# Altium schematic sheet CAN_PHY.SchDoc: CAN PHY
size A3; Author: Silvio Navaretti; CompanyName: ARDUINO; DrawnBy: Silvio Navaretti; Engineer: Silvio Navaretti; Organization: ARDUINO; SheetNumber: 48; SheetTotal: 51; RevAuthor: Silvio Navaretti
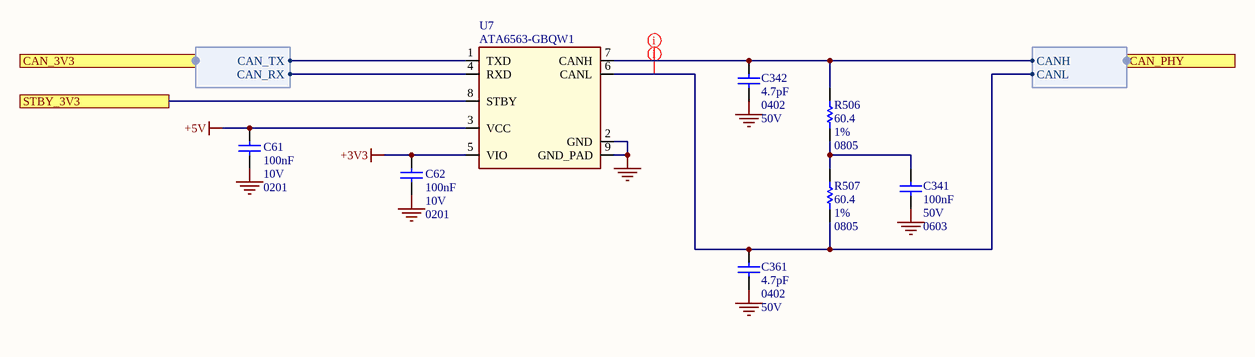
[diagram p0: CAN_PHY.SchDoc]

## Parts
C61  value 100nF  Voltage: 10V  Case Code (Imperial): 0201  [CAP-0201]  (hidden comment: CL03A104KP3NNNC)
C62  value 100nF  Voltage: 10V  Case Code (Imperial): 0201  [CAP-0201]  (hidden comment: CL03A104KP3NNNC)
C341  value 100nF  Voltage: 50V  Case Code (Imperial): 0603  [CAP-0603]  (hidden comment: 0603B104K500CT)
C342  value 4.7pF  Case Code (Imperial): 0402  Voltage: 50V  [CAP-0402]  (hidden comment: 04025A4R7DAT2A)
C361  value 4.7pF  Case Code (Imperial): 0402  Voltage: 50V  [CAP-0402]  (hidden comment: 04025A4R7DAT2A)
R506  value 60.4  Tolerance: 1%  Case Code (Imperial): 0805  [RES-0805]  (hidden comment: RT0805FRE0760R4L)
R507  value 60.4  Tolerance: 1%  Case Code (Imperial): 0805  [RES-0805]  (hidden comment: RT0805FRE0760R4L)
U7  ATA6563-GBQW1  [Microchip VDFN8 pitch 0.65mm 3x3mm exposed pad 2.4x1.6mm]

## Ports
CAN_3V3 (harness CAN), CAN_PHY (harness CAN_PHY), STBY_3V3

## Harnesses
CAN: CAN_TX, CAN_RX
CAN_PHY: CANH, CANL

## Nets
+3V3: C62.2 U7.5(VIO)
+5V: C61.2 U7.3(VCC)
GND: C61.1 C62.1 C341.2 C342.2 C361.2 U7.2(GND) U7.9(GND_PAD)
STBY_3V3: U7.8(STBY) ; port STBY_3V3
NetC341_1: C341.1 R506.1 R507.2
NetC342_1: C342.1 R506.2 U7.7(CANH) ; port CAN_PHY.CANH
NetC361_1: C361.1 R507.1 U7.6(CANL) ; port CAN_PHY.CANL
NetU7_1: U7.1(TXD) ; port CAN_3V3.CAN_TX
NetU7_4: U7.4(RXD) ; port CAN_3V3.CAN_RX

## Layout directives
net class HIGH_CLEARANCE: NetC342_1, NetC361_1

## Notes on the sheet
- Title:
- ID:
- Date:
- Time:
- Version:
- Sheet
- of
- RevAuthor:
- Reference Designs ARE PROVIDED "AS IS" AND "WITH ALL FAULTS. Arduino SA DISCLAIMS ALL OTHER WARRANTIES, EXPRESS OR IMPLIED, REGARDING PRODUCTS, INCLUDING BUT NOT LIMITED TO, ANY IMPLIED WARRANTIES OF MERCHANTABILITY OR FITNESS FOR A PARTICULAR PURPOSE.
  Arduino SA may make changes to specifications and product descriptions at any time, without notice. The Customer must not rely on the absence or characteristics of any features or instructions marked "reserved" or "undefined".
  Arduino SA reserves these for future definition and shall have no responsibility whatsoever for conflicts or incompatibilities arising from future changes to them. The product information on the Web Site or Materials is subject to change without notice.
  Do not finalize a design with this info. ARDUINO and other Arduino brands and logos and Trademarks of Arduino SA. All Arduino SA Trademarks cannot be used without owner's formal permission.
- File:
- Author:

## Library data of the parts
C61 C62 = C0113-A.6: CAP CHIP 0201 100nF 10% 10V X5R; Manufacturer: Samsung Electro-Mechanics; Code Arduino: C0113; Technology: Ceramic; Part Number: CL03A104KP3NNNC; Dielectric: X5R; Tolerance: 10%
C341 = C0043-A.14: CAP CHIP 0603 100nF 10% 50V X7R; Manufacturer: Walsin; Code Arduino: 0015; Part Number: 0603B104K500CT; Part number 3: CL10B104KB8NNNC; Manufacturer 3: Samsung Electro-Mechanics; Part number 2: C1608B104K500NT; Dielectric: X7R; Tolerance: 10%; Manufacturer 2: Hottech; Technology: Ceramic
C342 C361 = C0117-A.6: CAP CHIP 0402 4.7pF ±0.5pF 50V C0G; Manufacturer: AVX; Code Arduino: C0117; Tolerance: 4.7%; Dielectric: C0G; Part Number: 04025A4R7DAT2A; Technology: Ceramic
R506 R507 = R0422-A.1: RES CHIP 0805 60R4 1% 1/8W 50ppm; Manufacturer: YAGEO; Code Arduino: R0422; Power: 125mW; Part Number: RT0805FRE0760R4L; Temperature coefficient: 50ppm; Technology: Thick film
U7 = U0505-A.4: IC CAN FD PHY 5Mbps, VIO pin, Standby, VDFN8 3x3mm; Manufacturer: Microchip; Code Arduino: U0505; Part Number: ATA6563-GBQW1